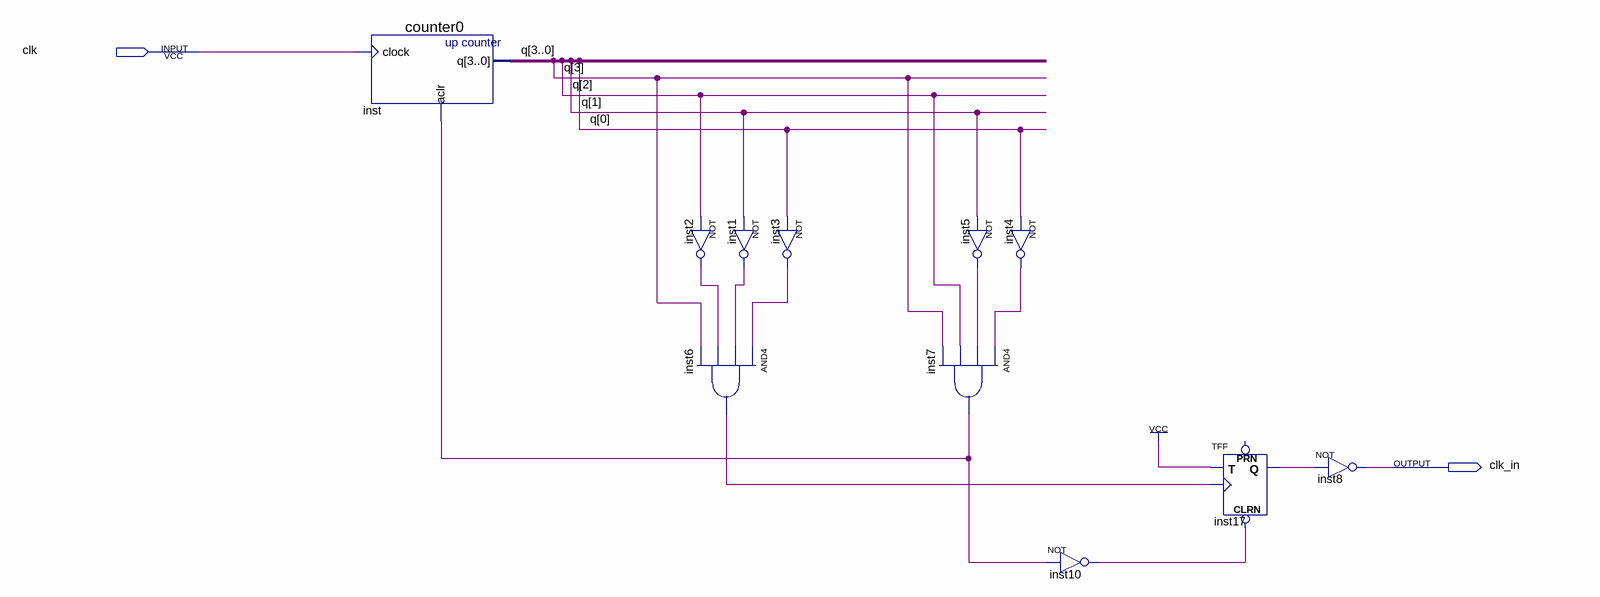
[diagram p0: schematic sheet]
// Quartus schematic lab2.bdf as structural Verilog: 11 symbols, 2 pins
module lab2 (
  input  clk,
  output clk_in
);

  wire inst1_out, inst2_out, inst3_out, inst4_out, inst5_out, inst6_out, inst7_out, inst10_out, inst17_q;
  wire [3:0] q;

  counter0 inst (.clock(clk), .aclr(inst7_out), .q(q));
  not inst1 (inst1_out, q[1]);
  not inst2 (inst2_out, q[2]);
  and inst6 (inst6_out, inst3_out, inst1_out, inst2_out, q[3]);
  not inst3 (inst3_out, q[0]);
  and inst7 (inst7_out, inst4_out, inst5_out, q[2], q[3]);
  not inst4 (inst4_out, q[0]);
  not inst5 (inst5_out, q[1]);
  not inst10 (inst10_out, inst7_out);
  TFF inst17 (.CLRN(inst10_out), .T(1'b1), .CLK(inst6_out), .Q(inst17_q));  // open: PRN
  not inst8 (clk_in, inst17_q);
endmodule
